# Altium schematic sheet Sheet1.SchDoc
size A
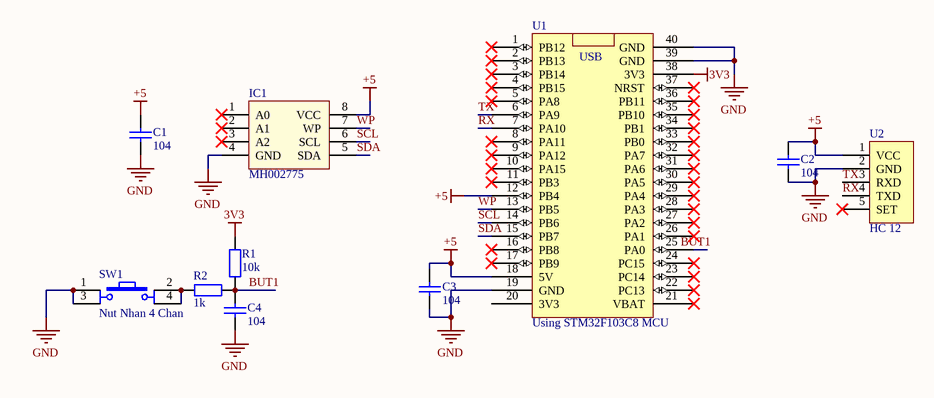
[diagram p0: Sheet1.SchDoc]

## Parts
C1  104  [tu 0805]
C2  104  [tu 0805]
C3  104  [tu 0805]
C4  104  [tu 0805]
IC1  MH002775  [DIP8]
R1  10k  [tro smd 0805]
R2  1k  [tro smd 0805]
SW1  Nut Nhan 4 Chan  [SW4]
U1  Using STM32F103C8 MCU  [STM32 BluePill]
U2  HC 12  [HC 12]

## Nets
3V3: R1.2 U1.38(3V3)
+5: C1.1 C2.1 C3.1 IC1.8(VCC) U1.12(PB4) U1.18(5V) U2.1(VCC)
GND: C1.2 C2.2 C3.2 C4.2 IC1.4(GND) SW1.1 SW1.3 U1.19(GND) U1.39(GND) U1.40(GND) U2.2(GND)
BUT1: C4.1 R1.1 R2.2
RX: U1.7(PA10) U2.4(TXD)
SCL: IC1.6(SCL) U1.14(PB6)
SDA: IC1.5(SDA) U1.15(PB7)
TX: U1.6(PA9) U2.3(RXD)
WP: IC1.7(WP) U1.13(PB5)
NetR2_1: R2.1 SW1.2 SW1.4

Not connected (* = marked no-connect by the designer): IC1 1(A0)* 2(A1)* 3(A2)*; U1 1(PB12)* 2(PB13)* 3(PB14)* 4(PB15)* 5(PA8)* 8(PA11)* 9(PA12)* 10(PA15)* 11(PB3)* 16(PB8)* 17(PB9)* 20(3V3) 21(VBAT)* 22(PC13)* 23(PC14)* 24(PC15)* 25(PA0) 26(PA1)* 27(PA2)* 28(PA3)* 29(PA4)* 30(PA5)* 31(PA6)* 32(PA7)* 33(PB0)* 34(PB1)* 35(PB10)* 36(PB11)* 37(NRST)*; U2 5(SET)*

## Notes on the sheet
- Labels drawn without touching a wire or pin: BUT1
- (in symbol BluePill) USB

## Library data of the parts
C1-C4 = Tu 0805 104 50V 10%: Dán; Don_Vi: Con; So_Chan: 2; Ten_Linh_Kien: Tụ 0805 104-100nF 10% 50V; Ma_Hang: MH004551; Chung_Loai: Dán; Kieu_Chan: *
IC1 = 24Cxx_MH: Dán; Ten_Linh_Kien: AT24C01 DIP8 EEPROM 1KBIT; Don_Vi: Con; Kieu_Chan: *; Ghi_Chu: *; Ma_Hang: MH002775; Chung_Loai: Dán
R1 = Tro 0805 1% 10k: Dán; Don_Vi: Con; So_Chan: 2; Ten_Linh_Kien: Trở 0805 1% 10k; Ma_Hang: MH005473; Chung_Loai: Dán; Kieu_Chan: *
R2 = Tro 0805 1% 3.3k: Dán; Don_Vi: Con; So_Chan: 2; Ten_Linh_Kien: Trở 0805 1% 3.3k; Ma_Hang: MH005472; Chung_Loai: Dán; Kieu_Chan: *
SW1 = Nut Nhan 4 Chan: Cắm; Value: Nút Nhấn 4 Chân 6x6x9MM DIP; Ma_Hang: MH004077; Don_Vi: Con; Kieu Chan: *; Ghi Chu: *
U1 = BluePill